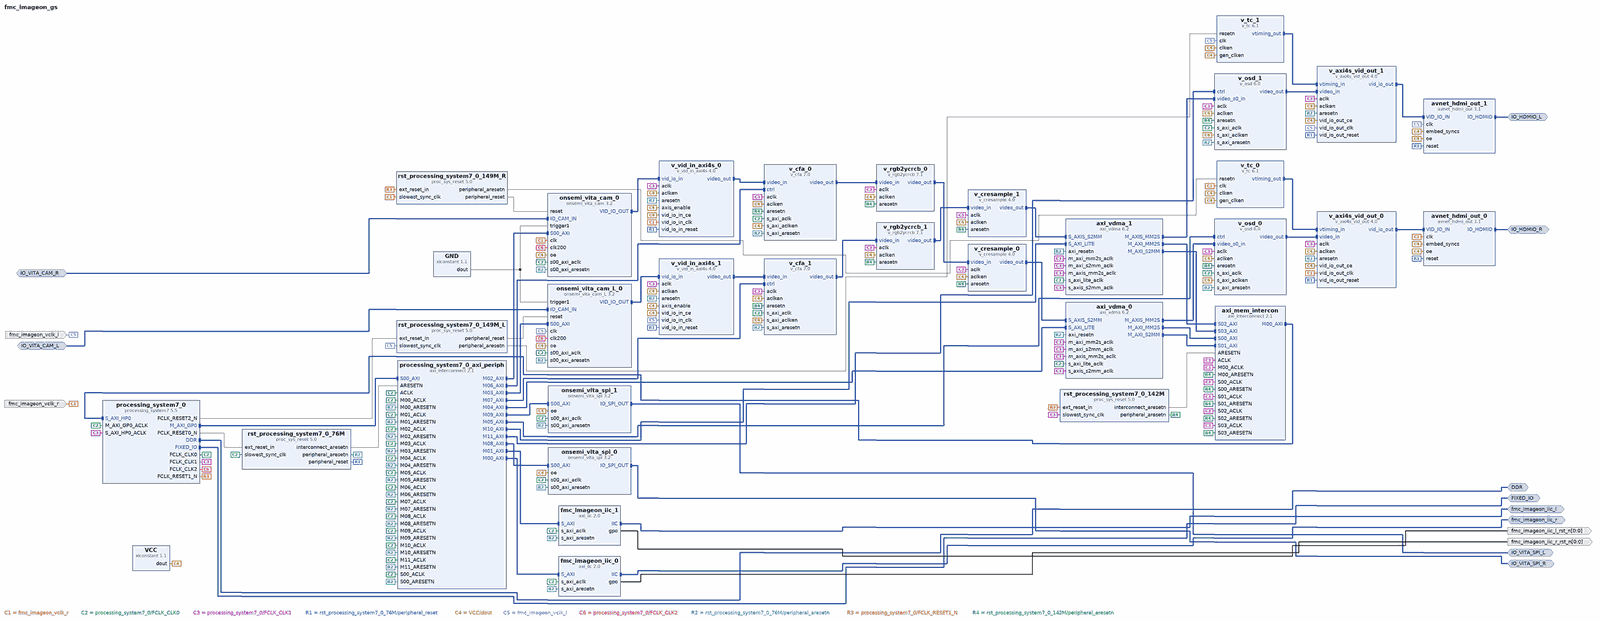
[diagram p0: block diagram of the top level, whole]
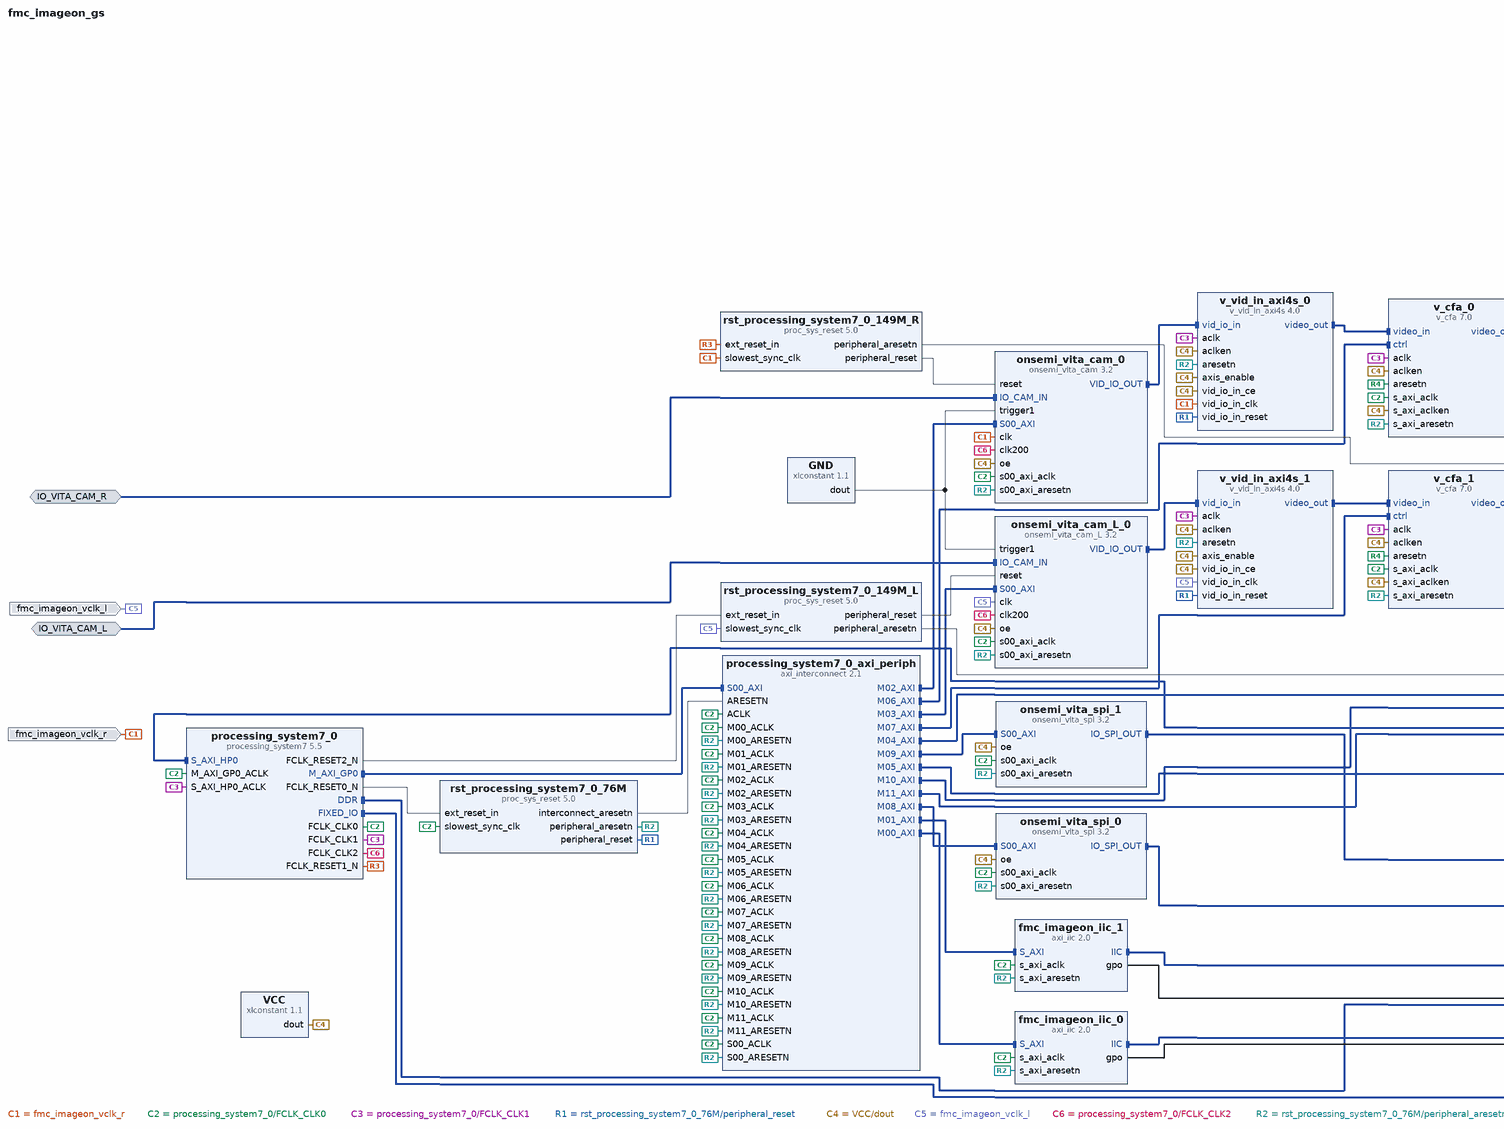
[diagram p1: block diagram of the top level, left part]
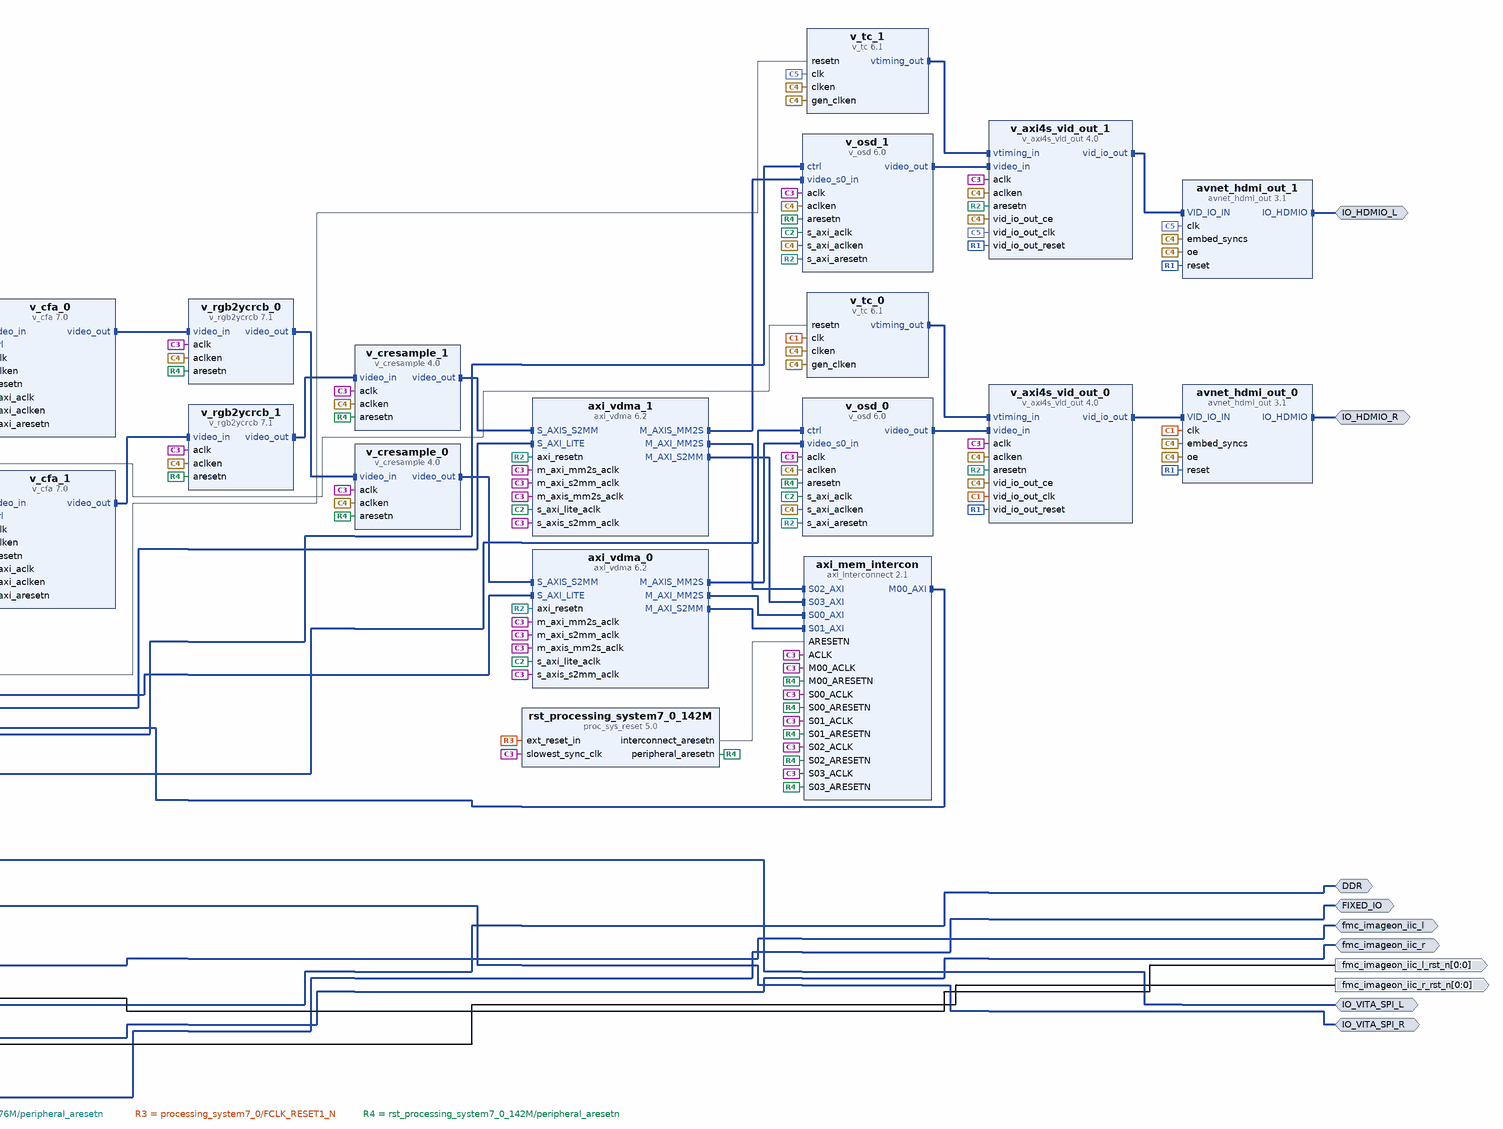
[diagram p2: block diagram of the top level, right part]
# Vivado block design fmc_imageon_gs, Vivado 2015.4
create_bd_design fmc_imageon_gs

create_bd_intf_port -mode Master -vlnv xilinx.com:interface:ddrx_rtl:1.0 DDR
create_bd_intf_port -mode Master -vlnv xilinx.com:display_processing_system7:fixedio_rtl:1.0 FIXED_IO
create_bd_intf_port -mode Master -vlnv avnet.com:interface:avnet_hdmi_rtl:1.0 IO_HDMIO_R
create_bd_intf_port -mode Master -vlnv xilinx.com:interface:iic_rtl:1.0 fmc_imageon_iic_r
create_bd_intf_port -mode Master -vlnv avnet.com:interface:avnet_hdmi_rtl:1.0 IO_HDMIO_L
create_bd_intf_port -mode Master -vlnv xilinx.com:interface:iic_rtl:1.0 fmc_imageon_iic_l
create_bd_intf_port -mode Slave -vlnv avnet.com:interface:onsemi_vita_cam_rtl:1.0 IO_VITA_CAM_R
create_bd_intf_port -mode Slave -vlnv avnet.com:interface:onsemi_vita_cam_rtl:1.0 IO_VITA_CAM_L
create_bd_intf_port -mode Master -vlnv avnet.com:interface:onsemi_vita_spi_rtl:1.0 IO_VITA_SPI_R
create_bd_intf_port -mode Master -vlnv avnet.com:interface:onsemi_vita_spi_rtl:1.0 IO_VITA_SPI_L
create_bd_port -dir I fmc_imageon_vclk_r
create_bd_port -dir O -from 0 -to 0 fmc_imageon_iic_r_rst_n
create_bd_port -dir I fmc_imageon_vclk_l
create_bd_port -dir O -from 0 -to 0 fmc_imageon_iic_l_rst_n

create_bd_cell -type ip -vlnv xilinx.com:ip:processing_system7:5.5 processing_system7_0
set_property -dict [list \
  CONFIG.PCW_FPGA0_PERIPHERAL_FREQMHZ 50 \
  CONFIG.PCW_FPGA1_PERIPHERAL_FREQMHZ 142 \
  CONFIG.PCW_FPGA2_PERIPHERAL_FREQMHZ 200 \
  CONFIG.PCW_FPGA3_PERIPHERAL_FREQMHZ 200 \
  CONFIG.PCW_USE_S_AXI_HP0 1 \
  CONFIG.PCW_EN_CLK1_PORT 1 \
  CONFIG.PCW_EN_CLK2_PORT 1 \
  CONFIG.PCW_EN_RST1_PORT 1 \
  CONFIG.PCW_EN_RST2_PORT 1 \
  CONFIG.PCW_QSPI_GRP_SINGLE_SS_ENABLE 1 \
  CONFIG.PCW_ENET0_PERIPHERAL_ENABLE 0 \
  CONFIG.PCW_SD0_PERIPHERAL_ENABLE 0 \
  CONFIG.PCW_TTC0_PERIPHERAL_ENABLE 1 \
  CONFIG.PCW_USB0_PERIPHERAL_ENABLE 0 \
  CONFIG.preset ZC702 \
] [get_bd_cells processing_system7_0]
# 9 more settings of processing_system7_0 are not shown: defaults, MIO pin electricals, DDR timing, and values the tool derives
create_bd_cell -type ip -vlnv xilinx.com:ip:v_cfa:7.0 v_cfa_0
set_property -dict [list \
  CONFIG.has_axi4_lite true \
  CONFIG.active_cols 1920 \
  CONFIG.active_rows 1080 \
  CONFIG.max_cols 1920 \
] [get_bd_cells v_cfa_0]
create_bd_cell -type ip -vlnv xilinx.com:ip:v_cresample:4.0 v_cresample_0
set_property -dict [list \
  CONFIG.active_cols 1920 \
  CONFIG.active_rows 1080 \
  CONFIG.s_axis_video_format 3 \
  CONFIG.m_axis_video_format 2 \
] [get_bd_cells v_cresample_0]
create_bd_cell -type ip -vlnv xilinx.com:ip:v_rgb2ycrcb:7.1 v_rgb2ycrcb_0
set_property -dict {CONFIG.ACTIVE_COLS 1920 CONFIG.ACTIVE_ROWS 1080} [get_bd_cells v_rgb2ycrcb_0]
create_bd_cell -type ip -vlnv xilinx.com:ip:v_tc:6.1 v_tc_0
set_property -dict [list \
  CONFIG.HAS_AXI4_LITE false \
  CONFIG.HAS_INTC_IF false \
  CONFIG.INTERLACE_EN false \
  CONFIG.VIDEO_MODE 1080p \
  CONFIG.enable_detection false \
  CONFIG.enable_generation true \
] [get_bd_cells v_tc_0]
create_bd_cell -type ip -vlnv xilinx.com:ip:axi_iic:2.0 fmc_imageon_iic_0
set_property -dict {CONFIG.USE_BOARD_FLOW true CONFIG.IIC_BOARD_INTERFACE Custom} [get_bd_cells fmc_imageon_iic_0]
create_bd_cell -type ip -vlnv xilinx.com:ip:axi_interconnect:2.1 processing_system7_0_axi_periph
set_property -dict {CONFIG.NUM_MI 12} [get_bd_cells processing_system7_0_axi_periph]
create_bd_cell -type ip -vlnv xilinx.com:ip:proc_sys_reset:5.0 rst_processing_system7_0_76M
create_bd_cell -type ip -vlnv xilinx.com:ip:v_axi4s_vid_out:4.0 v_axi4s_vid_out_0
set_property -dict {CONFIG.C_HAS_ASYNC_CLK 1 CONFIG.C_ADDR_WIDTH 12 CONFIG.C_VTG_MASTER_SLAVE 1} [get_bd_cells v_axi4s_vid_out_0]
create_bd_cell -type ip -vlnv xilinx.com:ip:v_vid_in_axi4s:4.0 v_vid_in_axi4s_0
set_property -dict [list \
  CONFIG.C_M_AXIS_VIDEO_FORMAT 12 \
  CONFIG.C_HAS_ASYNC_CLK 1 \
  CONFIG.C_ADDR_WIDTH 12 \
] [get_bd_cells v_vid_in_axi4s_0]
create_bd_cell -type ip -vlnv xilinx.com:ip:xlconstant:1.1 GND
set_property -dict {CONFIG.CONST_VAL 0} [get_bd_cells GND]
create_bd_cell -type ip -vlnv xilinx.com:ip:xlconstant:1.1 VCC
create_bd_cell -type ip -vlnv xilinx.com:ip:v_cfa:7.0 v_cfa_1
set_property -dict [list \
  CONFIG.has_axi4_lite true \
  CONFIG.active_cols 1920 \
  CONFIG.active_rows 1080 \
  CONFIG.max_cols 1920 \
] [get_bd_cells v_cfa_1]
create_bd_cell -type ip -vlnv xilinx.com:ip:v_cresample:4.0 v_cresample_1
set_property -dict [list \
  CONFIG.active_cols 1920 \
  CONFIG.active_rows 1080 \
  CONFIG.s_axis_video_format 3 \
  CONFIG.m_axis_video_format 2 \
] [get_bd_cells v_cresample_1]
create_bd_cell -type ip -vlnv xilinx.com:ip:v_rgb2ycrcb:7.1 v_rgb2ycrcb_1
set_property -dict {CONFIG.ACTIVE_COLS 1920 CONFIG.ACTIVE_ROWS 1080} [get_bd_cells v_rgb2ycrcb_1]
create_bd_cell -type ip -vlnv xilinx.com:ip:v_vid_in_axi4s:4.0 v_vid_in_axi4s_1
set_property -dict [list \
  CONFIG.C_M_AXIS_VIDEO_FORMAT 12 \
  CONFIG.C_HAS_ASYNC_CLK 1 \
  CONFIG.C_ADDR_WIDTH 12 \
] [get_bd_cells v_vid_in_axi4s_1]
create_bd_cell -type ip -vlnv xilinx.com:ip:axi_iic:2.0 fmc_imageon_iic_1
set_property -dict {CONFIG.USE_BOARD_FLOW true CONFIG.IIC_BOARD_INTERFACE Custom} [get_bd_cells fmc_imageon_iic_1]
create_bd_cell -type ip -vlnv xilinx.com:ip:v_axi4s_vid_out:4.0 v_axi4s_vid_out_1
set_property -dict {CONFIG.C_HAS_ASYNC_CLK 1 CONFIG.C_ADDR_WIDTH 12 CONFIG.C_VTG_MASTER_SLAVE 1} [get_bd_cells v_axi4s_vid_out_1]
create_bd_cell -type ip -vlnv xilinx.com:ip:v_tc:6.1 v_tc_1
set_property -dict [list \
  CONFIG.HAS_AXI4_LITE false \
  CONFIG.HAS_INTC_IF false \
  CONFIG.INTERLACE_EN false \
  CONFIG.VIDEO_MODE 1080p \
  CONFIG.enable_detection false \
] [get_bd_cells v_tc_1]
create_bd_cell -type ip -vlnv xilinx.com:ip:proc_sys_reset:5.0 rst_processing_system7_0_149M_R
create_bd_cell -type ip -vlnv xilinx.com:ip:proc_sys_reset:5.0 rst_processing_system7_0_149M_L
create_bd_cell -type ip -vlnv avnet:onsemi_vita:onsemi_vita_cam:3.2 onsemi_vita_cam_0
create_bd_cell -type ip -vlnv avnet:onsemi_vita:onsemi_vita_cam_L:3.2 onsemi_vita_cam_L_0
create_bd_cell -type ip -vlnv avnet:avnet_hdmi:avnet_hdmi_out:3.1 avnet_hdmi_out_0
create_bd_cell -type ip -vlnv avnet:avnet_hdmi:avnet_hdmi_out:3.1 avnet_hdmi_out_1
create_bd_cell -type ip -vlnv avnet:onsemi_vita:onsemi_vita_spi:3.2 onsemi_vita_spi_0
create_bd_cell -type ip -vlnv avnet:onsemi_vita:onsemi_vita_spi:3.2 onsemi_vita_spi_1
create_bd_cell -type ip -vlnv xilinx.com:ip:axi_vdma:6.2 axi_vdma_0
set_property -dict [list \
  CONFIG.c_m_axis_mm2s_tdata_width 16 \
  CONFIG.c_m_axi_s2mm_data_width 64 \
  CONFIG.c_mm2s_linebuffer_depth 4096 \
  CONFIG.c_s2mm_linebuffer_depth 4096 \
  CONFIG.c_mm2s_max_burst_length 256 \
  CONFIG.c_s2mm_max_burst_length 256 \
] [get_bd_cells axi_vdma_0]
create_bd_cell -type ip -vlnv xilinx.com:ip:v_osd:6.0 v_osd_0
set_property -dict [list \
  CONFIG.SCREEN_WIDTH 1920 \
  CONFIG.M_AXIS_VIDEO_WIDTH 1920 \
  CONFIG.M_AXIS_VIDEO_HEIGHT 1080 \
  CONFIG.LAYER0_HORIZONTAL_START_POSITION 0 \
  CONFIG.LAYER0_WIDTH 1920 \
  CONFIG.LAYER0_HEIGHT 1080 \
  CONFIG.LAYER1_HORIZONTAL_START_POSITION 0 \
  CONFIG.LAYER1_WIDTH 1280 \
  CONFIG.LAYER1_HEIGHT 720 \
  CONFIG.LAYER2_HORIZONTAL_START_POSITION 0 \
  CONFIG.LAYER2_WIDTH 1280 \
  CONFIG.LAYER2_HEIGHT 720 \
  CONFIG.LAYER3_HORIZONTAL_START_POSITION 0 \
  CONFIG.LAYER3_WIDTH 1280 \
  CONFIG.LAYER3_HEIGHT 720 \
  CONFIG.LAYER4_HORIZONTAL_START_POSITION 0 \
  CONFIG.LAYER4_WIDTH 1280 \
  CONFIG.LAYER4_HEIGHT 720 \
  CONFIG.LAYER5_HORIZONTAL_START_POSITION 0 \
  CONFIG.LAYER5_WIDTH 1280 \
  CONFIG.LAYER5_HEIGHT 720 \
  CONFIG.LAYER6_HORIZONTAL_START_POSITION 0 \
  CONFIG.LAYER6_WIDTH 1280 \
  CONFIG.LAYER6_HEIGHT 720 \
  CONFIG.LAYER7_HORIZONTAL_START_POSITION 0 \
  CONFIG.LAYER7_WIDTH 1280 \
  CONFIG.LAYER7_HEIGHT 720 \
] [get_bd_cells v_osd_0]
create_bd_cell -type ip -vlnv xilinx.com:ip:axi_vdma:6.2 axi_vdma_1
set_property -dict [list \
  CONFIG.c_m_axis_mm2s_tdata_width 16 \
  CONFIG.c_m_axi_s2mm_data_width 64 \
  CONFIG.c_mm2s_linebuffer_depth 4096 \
  CONFIG.c_s2mm_linebuffer_depth 4096 \
  CONFIG.c_mm2s_max_burst_length 256 \
  CONFIG.c_s2mm_max_burst_length 256 \
] [get_bd_cells axi_vdma_1]
create_bd_cell -type ip -vlnv xilinx.com:ip:v_osd:6.0 v_osd_1
set_property -dict [list \
  CONFIG.SCREEN_WIDTH 1920 \
  CONFIG.M_AXIS_VIDEO_WIDTH 1920 \
  CONFIG.M_AXIS_VIDEO_HEIGHT 1080 \
  CONFIG.LAYER0_HORIZONTAL_START_POSITION 0 \
  CONFIG.LAYER0_WIDTH 1920 \
  CONFIG.LAYER0_HEIGHT 1080 \
  CONFIG.LAYER1_HORIZONTAL_START_POSITION 0 \
  CONFIG.LAYER1_WIDTH 1280 \
  CONFIG.LAYER1_HEIGHT 720 \
  CONFIG.LAYER2_HORIZONTAL_START_POSITION 0 \
  CONFIG.LAYER2_WIDTH 1280 \
  CONFIG.LAYER2_HEIGHT 720 \
  CONFIG.LAYER3_HORIZONTAL_START_POSITION 0 \
  CONFIG.LAYER3_WIDTH 1280 \
  CONFIG.LAYER3_HEIGHT 720 \
  CONFIG.LAYER4_HORIZONTAL_START_POSITION 0 \
  CONFIG.LAYER4_WIDTH 1280 \
  CONFIG.LAYER4_HEIGHT 720 \
  CONFIG.LAYER5_HORIZONTAL_START_POSITION 0 \
  CONFIG.LAYER5_WIDTH 1280 \
  CONFIG.LAYER5_HEIGHT 720 \
  CONFIG.LAYER6_HORIZONTAL_START_POSITION 0 \
  CONFIG.LAYER6_WIDTH 1280 \
  CONFIG.LAYER6_HEIGHT 720 \
  CONFIG.LAYER7_HORIZONTAL_START_POSITION 0 \
  CONFIG.LAYER7_WIDTH 1280 \
  CONFIG.LAYER7_HEIGHT 720 \
] [get_bd_cells v_osd_1]
create_bd_cell -type ip -vlnv xilinx.com:ip:axi_interconnect:2.1 axi_mem_intercon
set_property -dict {CONFIG.NUM_SI 4 CONFIG.NUM_MI 1} [get_bd_cells axi_mem_intercon]
create_bd_cell -type ip -vlnv xilinx.com:ip:proc_sys_reset:5.0 rst_processing_system7_0_142M

# ---- connections ----

connect_bd_intf_net [get_bd_intf_pins processing_system7_0/M_AXI_GP0] [get_bd_intf_pins processing_system7_0_axi_periph/S00_AXI]
connect_bd_intf_net [get_bd_intf_pins fmc_imageon_iic_0/S_AXI] [get_bd_intf_pins processing_system7_0_axi_periph/M00_AXI]
connect_bd_intf_net [get_bd_intf_pins v_cfa_0/video_out] [get_bd_intf_pins v_rgb2ycrcb_0/video_in]
connect_bd_intf_net [get_bd_intf_pins v_cresample_0/video_in] [get_bd_intf_pins v_rgb2ycrcb_0/video_out]
connect_bd_intf_net [get_bd_intf_pins v_axi4s_vid_out_0/vtiming_in] [get_bd_intf_pins v_tc_0/vtiming_out]
connect_bd_intf_net [get_bd_intf_pins v_cfa_0/video_in] [get_bd_intf_pins v_vid_in_axi4s_0/video_out]
connect_bd_intf_net -intf_net v_vid_in_axi4s_2_video_out [get_bd_intf_pins v_vid_in_axi4s_1/video_out] [get_bd_intf_pins v_cfa_1/video_in]
connect_bd_intf_net [get_bd_intf_pins v_cfa_1/video_out] [get_bd_intf_pins v_rgb2ycrcb_1/video_in]
connect_bd_intf_net [get_bd_intf_pins v_rgb2ycrcb_1/video_out] [get_bd_intf_pins v_cresample_1/video_in]
connect_bd_intf_net [get_bd_intf_pins processing_system7_0_axi_periph/M01_AXI] [get_bd_intf_pins fmc_imageon_iic_1/S_AXI]
connect_bd_intf_net [get_bd_intf_pins processing_system7_0_axi_periph/M06_AXI] [get_bd_intf_pins v_cfa_0/ctrl]
connect_bd_intf_net [get_bd_intf_pins processing_system7_0_axi_periph/M07_AXI] [get_bd_intf_pins v_cfa_1/ctrl]
connect_bd_intf_net [get_bd_intf_pins v_tc_1/vtiming_out] [get_bd_intf_pins v_axi4s_vid_out_1/vtiming_in]
connect_bd_intf_net [get_bd_intf_pins processing_system7_0_axi_periph/M02_AXI] [get_bd_intf_pins onsemi_vita_cam_0/S00_AXI]
connect_bd_intf_net [get_bd_intf_pins onsemi_vita_cam_0/VID_IO_OUT] [get_bd_intf_pins v_vid_in_axi4s_0/vid_io_in]
connect_bd_intf_net [get_bd_intf_pins processing_system7_0_axi_periph/M03_AXI] [get_bd_intf_pins onsemi_vita_cam_L_0/S00_AXI]
connect_bd_intf_net [get_bd_intf_pins onsemi_vita_cam_L_0/VID_IO_OUT] [get_bd_intf_pins v_vid_in_axi4s_1/vid_io_in]
connect_bd_intf_net [get_bd_intf_pins v_axi4s_vid_out_0/vid_io_out] [get_bd_intf_pins avnet_hdmi_out_0/VID_IO_IN]
connect_bd_intf_net [get_bd_intf_pins avnet_hdmi_out_1/VID_IO_IN] [get_bd_intf_pins v_axi4s_vid_out_1/vid_io_out]
connect_bd_intf_net [get_bd_intf_pins processing_system7_0_axi_periph/M08_AXI] [get_bd_intf_pins onsemi_vita_spi_0/S00_AXI]
connect_bd_intf_net [get_bd_intf_pins processing_system7_0_axi_periph/M09_AXI] [get_bd_intf_pins onsemi_vita_spi_1/S00_AXI]
connect_bd_intf_net [get_bd_intf_pins v_cresample_0/video_out] [get_bd_intf_pins axi_vdma_0/S_AXIS_S2MM]
connect_bd_intf_net [get_bd_intf_pins axi_vdma_0/M_AXIS_MM2S] [get_bd_intf_pins v_osd_0/video_s0_in]
connect_bd_intf_net [get_bd_intf_pins axi_vdma_1/M_AXIS_MM2S] [get_bd_intf_pins v_osd_1/video_s0_in]
connect_bd_intf_net [get_bd_intf_pins v_osd_0/video_out] [get_bd_intf_pins v_axi4s_vid_out_0/video_in]
connect_bd_intf_net [get_bd_intf_pins v_cresample_1/video_out] [get_bd_intf_pins axi_vdma_1/S_AXIS_S2MM]
connect_bd_intf_net [get_bd_intf_pins v_axi4s_vid_out_1/video_in] [get_bd_intf_pins v_osd_1/video_out]
connect_bd_intf_net [get_bd_intf_pins processing_system7_0_axi_periph/M04_AXI] [get_bd_intf_pins axi_vdma_0/S_AXI_LITE]
connect_bd_intf_net [get_bd_intf_pins processing_system7_0_axi_periph/M05_AXI] [get_bd_intf_pins v_osd_0/ctrl]
connect_bd_intf_net [get_bd_intf_pins processing_system7_0_axi_periph/M10_AXI] [get_bd_intf_pins axi_vdma_1/S_AXI_LITE]
connect_bd_intf_net [get_bd_intf_pins processing_system7_0_axi_periph/M11_AXI] [get_bd_intf_pins v_osd_1/ctrl]
connect_bd_intf_net [get_bd_intf_pins axi_vdma_0/M_AXI_MM2S] [get_bd_intf_pins axi_mem_intercon/S00_AXI]
connect_bd_intf_net [get_bd_intf_pins axi_mem_intercon/M00_AXI] [get_bd_intf_pins processing_system7_0/S_AXI_HP0]
connect_bd_intf_net [get_bd_intf_pins axi_vdma_0/M_AXI_S2MM] [get_bd_intf_pins axi_mem_intercon/S01_AXI]
connect_bd_intf_net [get_bd_intf_pins axi_vdma_1/M_AXI_MM2S] [get_bd_intf_pins axi_mem_intercon/S02_AXI]
connect_bd_intf_net [get_bd_intf_pins axi_vdma_1/M_AXI_S2MM] [get_bd_intf_pins axi_mem_intercon/S03_AXI]
connect_bd_intf_net [get_bd_intf_ports DDR] [get_bd_intf_pins processing_system7_0/DDR]
connect_bd_intf_net [get_bd_intf_ports FIXED_IO] [get_bd_intf_pins processing_system7_0/FIXED_IO]
connect_bd_intf_net [get_bd_intf_ports IO_HDMIO_R] [get_bd_intf_pins avnet_hdmi_out_0/IO_HDMIO]
connect_bd_intf_net [get_bd_intf_ports fmc_imageon_iic_r] [get_bd_intf_pins fmc_imageon_iic_0/IIC]
connect_bd_intf_net [get_bd_intf_ports IO_HDMIO_L] [get_bd_intf_pins avnet_hdmi_out_1/IO_HDMIO]
connect_bd_intf_net [get_bd_intf_ports fmc_imageon_iic_l] [get_bd_intf_pins fmc_imageon_iic_1/IIC]
connect_bd_intf_net [get_bd_intf_ports IO_VITA_CAM_R] [get_bd_intf_pins onsemi_vita_cam_0/IO_CAM_IN]
connect_bd_intf_net [get_bd_intf_ports IO_VITA_CAM_L] [get_bd_intf_pins onsemi_vita_cam_L_0/IO_CAM_IN]
connect_bd_intf_net [get_bd_intf_ports IO_VITA_SPI_R] [get_bd_intf_pins onsemi_vita_spi_0/IO_SPI_OUT]
connect_bd_intf_net [get_bd_intf_ports IO_VITA_SPI_L] [get_bd_intf_pins onsemi_vita_spi_1/IO_SPI_OUT]
connect_bd_net -net clk_wiz_0_clk_out1 [get_bd_ports fmc_imageon_vclk_r] \
  [get_bd_pins v_axi4s_vid_out_0/vid_io_out_clk] [get_bd_pins v_vid_in_axi4s_0/vid_io_in_clk] [get_bd_pins v_tc_0/clk] \
  [get_bd_pins rst_processing_system7_0_149M_R/slowest_sync_clk] [get_bd_pins onsemi_vita_cam_0/clk] \
  [get_bd_pins avnet_hdmi_out_0/clk]
connect_bd_net [get_bd_pins fmc_imageon_iic_0/gpo] [get_bd_ports fmc_imageon_iic_r_rst_n]
connect_bd_net [get_bd_pins processing_system7_0/FCLK_CLK0] \
  [get_bd_pins fmc_imageon_iic_0/s_axi_aclk] [get_bd_pins processing_system7_0/M_AXI_GP0_ACLK] \
  [get_bd_pins rst_processing_system7_0_76M/slowest_sync_clk] [get_bd_pins v_cfa_0/s_axi_aclk] \
  [get_bd_pins v_cfa_1/s_axi_aclk] [get_bd_pins fmc_imageon_iic_1/s_axi_aclk] [get_bd_pins onsemi_vita_cam_0/s00_axi_aclk] \
  [get_bd_pins onsemi_vita_cam_L_0/s00_axi_aclk] [get_bd_pins onsemi_vita_spi_0/s00_axi_aclk] \
  [get_bd_pins onsemi_vita_spi_1/s00_axi_aclk] [get_bd_pins axi_vdma_0/s_axi_lite_aclk] [get_bd_pins v_osd_0/s_axi_aclk] \
  [get_bd_pins axi_vdma_1/s_axi_lite_aclk] [get_bd_pins v_osd_1/s_axi_aclk] \
  [get_bd_pins processing_system7_0_axi_periph/ACLK] [get_bd_pins processing_system7_0_axi_periph/M00_ACLK] \
  [get_bd_pins processing_system7_0_axi_periph/M01_ACLK] [get_bd_pins processing_system7_0_axi_periph/M02_ACLK] \
  [get_bd_pins processing_system7_0_axi_periph/M03_ACLK] [get_bd_pins processing_system7_0_axi_periph/M04_ACLK] \
  [get_bd_pins processing_system7_0_axi_periph/M05_ACLK] [get_bd_pins processing_system7_0_axi_periph/M06_ACLK] \
  [get_bd_pins processing_system7_0_axi_periph/S00_ACLK] [get_bd_pins processing_system7_0_axi_periph/M07_ACLK] \
  [get_bd_pins processing_system7_0_axi_periph/M08_ACLK] [get_bd_pins processing_system7_0_axi_periph/M09_ACLK] \
  [get_bd_pins processing_system7_0_axi_periph/M10_ACLK] [get_bd_pins processing_system7_0_axi_periph/M11_ACLK]
connect_bd_net [get_bd_pins processing_system7_0/FCLK_CLK1] \
  [get_bd_pins v_axi4s_vid_out_0/aclk] [get_bd_pins v_cfa_0/aclk] [get_bd_pins v_cresample_0/aclk] \
  [get_bd_pins v_rgb2ycrcb_0/aclk] [get_bd_pins v_vid_in_axi4s_0/aclk] [get_bd_pins v_cresample_1/aclk] \
  [get_bd_pins v_rgb2ycrcb_1/aclk] [get_bd_pins v_cfa_1/aclk] [get_bd_pins v_vid_in_axi4s_1/aclk] \
  [get_bd_pins v_axi4s_vid_out_1/aclk] [get_bd_pins v_osd_0/aclk] [get_bd_pins axi_vdma_0/m_axi_mm2s_aclk] \
  [get_bd_pins axi_vdma_0/m_axis_mm2s_aclk] [get_bd_pins axi_vdma_0/m_axi_s2mm_aclk] \
  [get_bd_pins axi_vdma_0/s_axis_s2mm_aclk] [get_bd_pins axi_vdma_1/m_axi_mm2s_aclk] \
  [get_bd_pins axi_vdma_1/m_axis_mm2s_aclk] [get_bd_pins axi_vdma_1/m_axi_s2mm_aclk] \
  [get_bd_pins axi_vdma_1/s_axis_s2mm_aclk] [get_bd_pins v_osd_1/aclk] \
  [get_bd_pins rst_processing_system7_0_142M/slowest_sync_clk] [get_bd_pins processing_system7_0/S_AXI_HP0_ACLK] \
  [get_bd_pins axi_mem_intercon/S00_ACLK] [get_bd_pins axi_mem_intercon/ACLK] [get_bd_pins axi_mem_intercon/M00_ACLK] \
  [get_bd_pins axi_mem_intercon/S01_ACLK] [get_bd_pins axi_mem_intercon/S02_ACLK] [get_bd_pins axi_mem_intercon/S03_ACLK]
connect_bd_net [get_bd_pins processing_system7_0/FCLK_RESET0_N] [get_bd_pins rst_processing_system7_0_76M/ext_reset_in]
connect_bd_net [get_bd_pins rst_processing_system7_0_76M/interconnect_aresetn] [get_bd_pins processing_system7_0_axi_periph/ARESETN]
connect_bd_net -net xlconstant_0_dout [get_bd_pins rst_processing_system7_0_76M/peripheral_reset] \
  [get_bd_pins v_vid_in_axi4s_1/vid_io_in_reset] [get_bd_pins v_vid_in_axi4s_0/vid_io_in_reset] \
  [get_bd_pins v_axi4s_vid_out_0/vid_io_out_reset] [get_bd_pins v_axi4s_vid_out_1/vid_io_out_reset] \
  [get_bd_pins avnet_hdmi_out_0/reset] [get_bd_pins avnet_hdmi_out_1/reset]
connect_bd_net -net xlconstant_1_dout [get_bd_pins VCC/dout] \
  [get_bd_pins v_axi4s_vid_out_0/vid_io_out_ce] [get_bd_pins v_cfa_0/s_axi_aclken] [get_bd_pins v_cresample_0/aclken] \
  [get_bd_pins v_tc_0/clken] [get_bd_pins v_vid_in_axi4s_0/aclken] [get_bd_pins v_vid_in_axi4s_0/axis_enable] \
  [get_bd_pins v_vid_in_axi4s_0/vid_io_in_ce] [get_bd_pins v_vid_in_axi4s_1/vid_io_in_ce] \
  [get_bd_pins v_vid_in_axi4s_1/aclken] [get_bd_pins v_vid_in_axi4s_1/axis_enable] [get_bd_pins v_cfa_1/aclken] \
  [get_bd_pins v_cfa_1/s_axi_aclken] [get_bd_pins v_rgb2ycrcb_0/aclken] [get_bd_pins v_tc_1/clken] \
  [get_bd_pins v_axi4s_vid_out_1/vid_io_out_ce] [get_bd_pins v_axi4s_vid_out_1/aclken] [get_bd_pins v_cfa_0/aclken] \
  [get_bd_pins v_axi4s_vid_out_0/aclken] [get_bd_pins onsemi_vita_cam_0/oe] [get_bd_pins onsemi_vita_cam_L_0/oe] \
  [get_bd_pins avnet_hdmi_out_0/oe] [get_bd_pins avnet_hdmi_out_0/embed_syncs] [get_bd_pins avnet_hdmi_out_1/oe] \
  [get_bd_pins avnet_hdmi_out_1/embed_syncs] [get_bd_pins onsemi_vita_spi_0/oe] [get_bd_pins onsemi_vita_spi_1/oe] \
  [get_bd_pins v_tc_1/gen_clken] [get_bd_pins v_tc_0/gen_clken] [get_bd_pins v_osd_0/aclken] \
  [get_bd_pins v_osd_0/s_axi_aclken] [get_bd_pins v_osd_1/aclken] [get_bd_pins v_osd_1/s_axi_aclken] \
  [get_bd_pins v_cresample_1/aclken] [get_bd_pins v_rgb2ycrcb_1/aclken]
connect_bd_net -net clk_2 [get_bd_ports fmc_imageon_vclk_l] \
  [get_bd_pins v_vid_in_axi4s_1/vid_io_in_clk] [get_bd_pins v_tc_1/clk] [get_bd_pins v_axi4s_vid_out_1/vid_io_out_clk] \
  [get_bd_pins rst_processing_system7_0_149M_L/slowest_sync_clk] [get_bd_pins onsemi_vita_cam_L_0/clk] \
  [get_bd_pins avnet_hdmi_out_1/clk]
connect_bd_net [get_bd_pins processing_system7_0/FCLK_CLK2] [get_bd_pins onsemi_vita_cam_0/clk200] [get_bd_pins onsemi_vita_cam_L_0/clk200]
connect_bd_net [get_bd_pins rst_processing_system7_0_76M/peripheral_aresetn] \
  [get_bd_pins fmc_imageon_iic_0/s_axi_aresetn] [get_bd_pins v_cfa_0/s_axi_aresetn] [get_bd_pins v_vid_in_axi4s_0/aresetn] \
  [get_bd_pins v_vid_in_axi4s_1/aresetn] [get_bd_pins v_cfa_1/s_axi_aresetn] [get_bd_pins fmc_imageon_iic_1/s_axi_aresetn] \
  [get_bd_pins onsemi_vita_cam_0/s00_axi_aresetn] [get_bd_pins onsemi_vita_cam_L_0/s00_axi_aresetn] \
  [get_bd_pins onsemi_vita_spi_0/s00_axi_aresetn] [get_bd_pins onsemi_vita_spi_1/s00_axi_aresetn] \
  [get_bd_pins v_axi4s_vid_out_0/aresetn] [get_bd_pins v_axi4s_vid_out_1/aresetn] [get_bd_pins axi_vdma_0/axi_resetn] \
  [get_bd_pins v_osd_0/s_axi_aresetn] [get_bd_pins axi_vdma_1/axi_resetn] [get_bd_pins v_osd_1/s_axi_aresetn] \
  [get_bd_pins processing_system7_0_axi_periph/M00_ARESETN] [get_bd_pins processing_system7_0_axi_periph/M01_ARESETN] \
  [get_bd_pins processing_system7_0_axi_periph/M02_ARESETN] [get_bd_pins processing_system7_0_axi_periph/M03_ARESETN] \
  [get_bd_pins processing_system7_0_axi_periph/M04_ARESETN] [get_bd_pins processing_system7_0_axi_periph/M05_ARESETN] \
  [get_bd_pins processing_system7_0_axi_periph/M06_ARESETN] [get_bd_pins processing_system7_0_axi_periph/S00_ARESETN] \
  [get_bd_pins processing_system7_0_axi_periph/M07_ARESETN] [get_bd_pins processing_system7_0_axi_periph/M08_ARESETN] \
  [get_bd_pins processing_system7_0_axi_periph/M09_ARESETN] [get_bd_pins processing_system7_0_axi_periph/M10_ARESETN] \
  [get_bd_pins processing_system7_0_axi_periph/M11_ARESETN]
connect_bd_net [get_bd_pins fmc_imageon_iic_1/gpo] [get_bd_ports fmc_imageon_iic_l_rst_n]
connect_bd_net [get_bd_pins rst_processing_system7_0_149M_L/peripheral_aresetn] [get_bd_pins v_tc_1/resetn]
connect_bd_net [get_bd_pins processing_system7_0/FCLK_RESET1_N] \
  [get_bd_pins rst_processing_system7_0_149M_R/ext_reset_in] [get_bd_pins rst_processing_system7_0_142M/ext_reset_in]
connect_bd_net [get_bd_pins processing_system7_0/FCLK_RESET2_N] [get_bd_pins rst_processing_system7_0_149M_L/ext_reset_in]
connect_bd_net [get_bd_pins rst_processing_system7_0_149M_L/peripheral_reset] [get_bd_pins onsemi_vita_cam_L_0/reset]
connect_bd_net [get_bd_pins rst_processing_system7_0_149M_R/peripheral_reset] [get_bd_pins onsemi_vita_cam_0/reset]
connect_bd_net [get_bd_pins rst_processing_system7_0_149M_R/peripheral_aresetn] [get_bd_pins v_tc_0/resetn]
connect_bd_net [get_bd_pins rst_processing_system7_0_142M/peripheral_aresetn] \
  [get_bd_pins v_cfa_1/aresetn] [get_bd_pins v_rgb2ycrcb_1/aresetn] [get_bd_pins v_cresample_1/aresetn] \
  [get_bd_pins v_osd_1/aresetn] [get_bd_pins v_cfa_0/aresetn] [get_bd_pins v_rgb2ycrcb_0/aresetn] \
  [get_bd_pins v_cresample_0/aresetn] [get_bd_pins v_osd_0/aresetn] [get_bd_pins axi_mem_intercon/S00_ARESETN] \
  [get_bd_pins axi_mem_intercon/M00_ARESETN] [get_bd_pins axi_mem_intercon/S01_ARESETN] \
  [get_bd_pins axi_mem_intercon/S02_ARESETN] [get_bd_pins axi_mem_intercon/S03_ARESETN]
connect_bd_net [get_bd_pins rst_processing_system7_0_142M/interconnect_aresetn] [get_bd_pins axi_mem_intercon/ARESETN]
connect_bd_net [get_bd_pins GND/dout] [get_bd_pins onsemi_vita_cam_0/trigger1] [get_bd_pins onsemi_vita_cam_L_0/trigger1]

# ---- address map ----
assign_bd_address -offset 0x00000000 -range 512M -target_address_space [get_bd_addr_spaces axi_vdma_0/Data_MM2S] [get_bd_addr_segs processing_system7_0/S_AXI_HP0/HP0_DDR_LOWOCM]
assign_bd_address -offset 0x00000000 -range 512M -target_address_space [get_bd_addr_spaces axi_vdma_0/Data_S2MM] [get_bd_addr_segs processing_system7_0/S_AXI_HP0/HP0_DDR_LOWOCM]
assign_bd_address -offset 0x00000000 -range 512M -target_address_space [get_bd_addr_spaces axi_vdma_1/Data_MM2S] [get_bd_addr_segs processing_system7_0/S_AXI_HP0/HP0_DDR_LOWOCM]
assign_bd_address -offset 0x00000000 -range 512M -target_address_space [get_bd_addr_spaces axi_vdma_1/Data_S2MM] [get_bd_addr_segs processing_system7_0/S_AXI_HP0/HP0_DDR_LOWOCM]
assign_bd_address -offset 0x41600000 -range 64K -target_address_space [get_bd_addr_spaces processing_system7_0/Data] [get_bd_addr_segs fmc_imageon_iic_0/S_AXI/Reg]
assign_bd_address -offset 0x41610000 -range 64K -target_address_space [get_bd_addr_spaces processing_system7_0/Data] [get_bd_addr_segs fmc_imageon_iic_1/S_AXI/Reg]
assign_bd_address -offset 0x43000000 -range 64K -target_address_space [get_bd_addr_spaces processing_system7_0/Data] [get_bd_addr_segs axi_vdma_0/S_AXI_LITE/Reg]
assign_bd_address -offset 0x43010000 -range 64K -target_address_space [get_bd_addr_spaces processing_system7_0/Data] [get_bd_addr_segs axi_vdma_1/S_AXI_LITE/Reg]
assign_bd_address -offset 0x43C00000 -range 64K -target_address_space [get_bd_addr_spaces processing_system7_0/Data] [get_bd_addr_segs onsemi_vita_spi_0/S00_AXI/Reg]
assign_bd_address -offset 0x43C10000 -range 64K -target_address_space [get_bd_addr_spaces processing_system7_0/Data] [get_bd_addr_segs onsemi_vita_spi_1/S00_AXI/Reg]
assign_bd_address -offset 0x43C20000 -range 64K -target_address_space [get_bd_addr_spaces processing_system7_0/Data] [get_bd_addr_segs v_cfa_0/ctrl/Reg]
assign_bd_address -offset 0x43C30000 -range 64K -target_address_space [get_bd_addr_spaces processing_system7_0/Data] [get_bd_addr_segs v_cfa_1/ctrl/Reg]
assign_bd_address -offset 0x43C60000 -range 64K -target_address_space [get_bd_addr_spaces processing_system7_0/Data] [get_bd_addr_segs onsemi_vita_cam_0/S00_AXI/Reg]
assign_bd_address -offset 0x43C70000 -range 64K -target_address_space [get_bd_addr_spaces processing_system7_0/Data] [get_bd_addr_segs onsemi_vita_cam_L_0/S00_AXI/Reg]
assign_bd_address -offset 0x43C80000 -range 64K -target_address_space [get_bd_addr_spaces processing_system7_0/Data] [get_bd_addr_segs v_osd_0/ctrl/Reg]
assign_bd_address -offset 0x43C90000 -range 64K -target_address_space [get_bd_addr_spaces processing_system7_0/Data] [get_bd_addr_segs v_osd_1/ctrl/Reg]

validate_bd_design
save_bd_design
